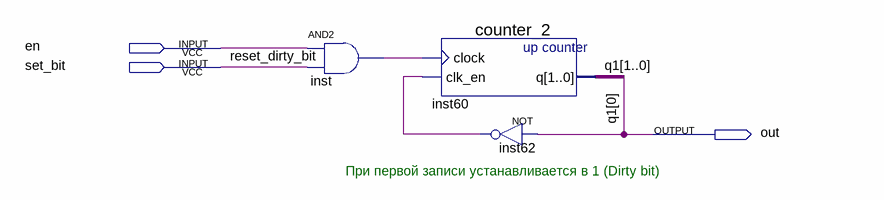
[diagram p0: schematic sheet]
// Quartus schematic dirty_bit.bdf as structural Verilog: 3 symbols, 3 pins
module dirty_bit (
  input  en,
  input  set_bit,
  output out
);

  wire inst62_out, inst_out;
  wire [1:1] q1;

  and inst (inst_out, en, set_bit);
  counter_2 inst60 (.clock(inst_out), .clk_en(inst62_out), .q({q1[1], out}));
  not inst62 (inst62_out, out);

  // Other names for the same wires on the sheet: q1[0] = out; reset_dirty_bit = set_bit

  // Notes on the sheet:
  //   При первой записи устанавливается в 1 (Dirty bit)
endmodule
